# Altium schematic sheet 05-温湿度传感器模块-原理图.SchDoc
size A4
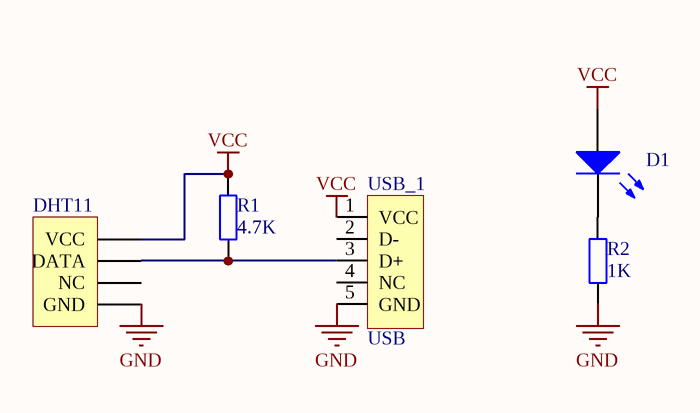
[diagram p0: 05-温湿度传感器模块-原理图.SchDoc]

## Parts
D1  LED0  [0805]  (value not drawn)
DHT11  Header 4  [DHT11]  (value not drawn)
R1  value 4.7K  [0805]  (hidden comment: Res2)
R2  value 1K  [0805]  (hidden comment: Res2)
USB_1  USB  [USB/SM0.8-6H5]

## Nets
GND: DHT11.4(GND) R2.1 USB_1.5(GND)
VCC: D1.1(A) DHT11.1(VCC) R1.2 USB_1.1(VCC)
NetD1_2: D1.2(K) R2.2
NetDHT11_2: DHT11.2(DATA) R1.1 USB_1.3(D+)

Not connected (* = marked no-connect by the designer): DHT11 3(NC); USB_1 2(D-) 4(NC)

## Library data of the parts
D1 = LED0: Typical INFRARED GaAs LED; Published: 8-Jun-2000; LatestRevisionDate: 08-Jul-2005; LatestRevisionNote: Mech Layer 1 removed.; PackageReference: LED-0; Publisher: Altium Limited
DHT11 = Header 4: Header, 4-Pin; LatestRevisionDate: 17-Jul-2002; LatestRevisionNote: Re-released for DXP Platform.; Publisher: Altium Limited
R1 R2 = Res2: Resistor; Published: 8-Jun-2000; LatestRevisionDate: 17-Jul-2002; LatestRevisionNote: Re-released for DXP Platform.; PackageReference: AXIAL-0.4; Publisher: Altium Limited
USB_1 = USB5